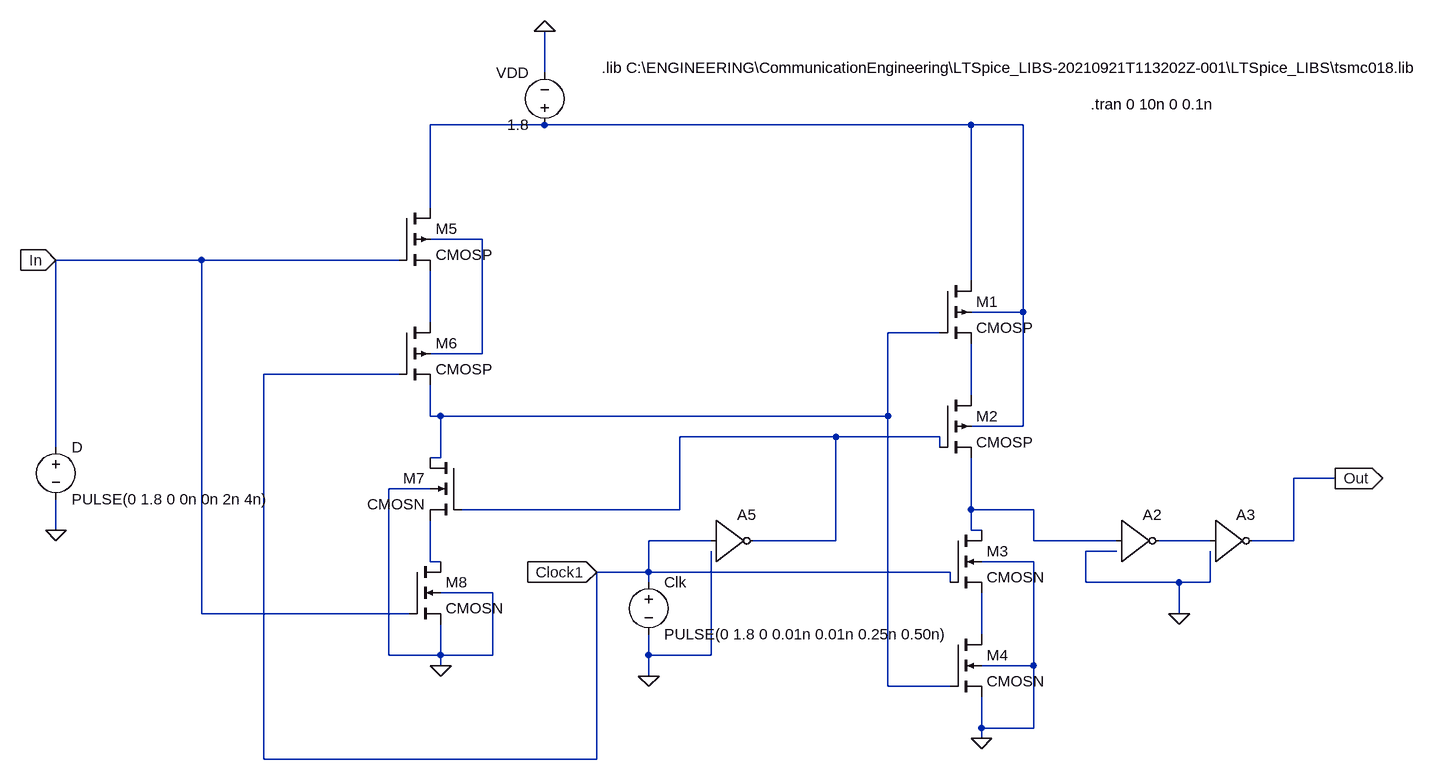
[diagram p0: schematic D_Flip_Flop_M_S__1.asc]
D_Flip_Flop_M_S__1.asc, the LTspice schematic file:
Version 4
SHEET 1 1376 1044
WIRE -160 -16 -160 -80
WIRE -160 64 -336 64
WIRE 496 64 -160 64
WIRE 576 64 496 64
WIRE -336 192 -336 64
WIRE -256 240 -336 240
WIRE -688 272 -912 272
WIRE -384 272 -688 272
WIRE 496 304 496 64
WIRE 576 352 576 64
WIRE 576 352 496 352
WIRE -336 368 -336 288
WIRE 448 384 368 384
WIRE -256 416 -256 240
WIRE -256 416 -336 416
WIRE -384 448 -592 448
WIRE 496 480 496 400
WIRE -336 512 -336 464
WIRE -320 512 -336 512
WIRE 368 512 368 384
WIRE 368 512 -320 512
WIRE 576 528 576 352
WIRE 576 528 496 528
WIRE 288 544 48 544
WIRE 448 544 288 544
WIRE -912 560 -912 272
WIRE 448 560 448 544
WIRE -320 576 -320 512
WIRE -320 576 -336 576
WIRE 1056 608 992 608
WIRE -336 624 -400 624
WIRE 48 656 48 544
WIRE 48 656 -288 656
WIRE 496 656 496 576
WIRE 592 656 496 656
WIRE -912 688 -912 640
WIRE 496 688 496 656
WIRE 512 688 496 688
WIRE 96 704 0 704
WIRE 288 704 288 544
WIRE 288 704 160 704
WIRE 592 704 592 656
WIRE 720 704 592 704
WIRE 864 704 784 704
WIRE 992 704 992 608
WIRE 992 704 928 704
WIRE 720 720 672 720
WIRE -336 736 -336 672
WIRE -320 736 -336 736
WIRE 592 736 512 736
WIRE 0 752 0 704
WIRE 0 752 -80 752
WIRE 464 752 0 752
WIRE 0 768 0 752
WIRE 464 768 464 752
WIRE 672 768 672 720
WIRE 816 768 672 768
WIRE 864 768 864 720
WIRE 864 768 816 768
WIRE -240 784 -320 784
WIRE -688 816 -688 272
WIRE -368 816 -688 816
WIRE 816 816 816 768
WIRE 512 848 512 784
WIRE -400 880 -400 624
WIRE -320 880 -320 832
WIRE -320 880 -400 880
WIRE -240 880 -240 784
WIRE -240 880 -320 880
WIRE 0 880 0 848
WIRE 96 880 96 720
WIRE 96 880 0 880
WIRE -320 896 -320 880
WIRE 592 896 592 736
WIRE 592 896 512 896
WIRE 0 912 0 880
WIRE 368 928 368 512
WIRE 464 928 368 928
WIRE 512 992 512 944
WIRE 592 992 592 896
WIRE 592 992 512 992
WIRE 512 1008 512 992
WIRE -592 1040 -592 448
WIRE -80 1040 -80 752
WIRE -80 1040 -592 1040
FLAG -160 -80 0
FLAG 0 912 0
FLAG 512 1008 0
FLAG -320 896 0
FLAG -912 688 0
FLAG -912 272 In
IOPIN -912 272 In
FLAG 1056 608 Out
IOPIN 1056 608 Out
FLAG -80 752 Clock1
IOPIN -80 752 In
FLAG 816 816 0
SYMBOL pmos4 448 304 R0
SYMATTR InstName M1
SYMATTR Value CMOSP
SYMATTR Value2 l=180n w=660n
SYMBOL pmos4 448 480 R0
SYMATTR InstName M2
SYMATTR Value CMOSP
SYMATTR Value2 l=180n w=660n
SYMBOL nmos4 464 688 R0
SYMATTR InstName M3
SYMATTR Value CMOSN
SYMATTR Value2 l=180n w=220n
SYMBOL nmos4 464 848 R0
SYMATTR InstName M4
SYMATTR Value CMOSN
SYMATTR Value2 l=180n w=220n
SYMBOL voltage -160 80 R180
WINDOW 0 24 96 Left 2
WINDOW 3 24 16 Left 2
SYMATTR InstName VDD
SYMATTR Value 1.8
SYMBOL voltage 0 752 R0
WINDOW 123 0 0 Left 0
WINDOW 39 0 0 Left 0
SYMATTR InstName Clk
SYMATTR Value PULSE(0 1.8 0 0.01n 0.01n 0.25n 0.50n)
SYMBOL pmos4 -384 192 R0
SYMATTR InstName M5
SYMATTR Value CMOSP
SYMATTR Value2 l=180n w=660n
SYMBOL pmos4 -384 368 R0
SYMATTR InstName M6
SYMATTR Value CMOSP
SYMATTR Value2 l=180n w=660n
SYMBOL nmos4 -288 576 M0
SYMATTR InstName M7
SYMATTR Value CMOSN
SYMATTR Value2 l=180n w=220n
SYMBOL nmos4 -368 736 R0
SYMATTR InstName M8
SYMATTR Value CMOSN
SYMATTR Value2 l=180n w=220n
SYMBOL voltage -912 544 R0
WINDOW 123 0 0 Left 0
WINDOW 39 0 0 Left 0
SYMATTR InstName D
SYMATTR Value PULSE(0 1.8 0 0n 0n 2n 4n)
SYMBOL Digital\\inv 720 640 R0
SYMATTR InstName A2
SYMBOL Digital\\inv 864 640 R0
SYMATTR InstName A3
SYMBOL Digital\\inv 96 640 R0
SYMATTR InstName A5
TEXT -72 -24 Left 2 !.lib C:\\ENGINEERING\\CommunicationEngineering\\LTSpice_LIBS-20210921T113202Z-001\\LTSpice_LIBS\\tsmc018.lib
TEXT 680 32 Left 2 !.tran 0 10n 0 0.1n

The netlist it stands for:
* D_Flip_Flop_M_S__1.asc
M1 N001 N004 N005 N001 CMOSP l=180n w=660n
M2 N005 N006 N007 N001 CMOSP l=180n w=660n
M3 N007 Clock1 N010 0 CMOSN l=180n w=220n
M4 N010 N004 0 0 CMOSN l=180n w=220n
VDD N001 0 1.8
V§Clk Clock1 0 PULSE(0 1.8 0 0.01n 0.01n 0.25n 0.50n)
M5 N001 In N003 N002 CMOSP l=180n w=660n
M6 N003 Clock1 N004 N002 CMOSP l=180n w=660n
M7 N004 N006 N009 0 CMOSN l=180n w=220n
M8 N009 In 0 0 CMOSN l=180n w=220n
V§D In 0 PULSE(0 1.8 0 0n 0n 2n 4n)
A2 N007 0 0 0 0 N008 0 0 BUF
A3 N008 0 0 0 0 Out 0 0 BUF
A5 Clock1 0 0 0 0 N006 0 0 BUF
.model NMOS NMOS
.model PMOS PMOS
.lib standard.mos
.lib C:\ENGINEERING\CommunicationEngineering\LTSpice_LIBS-20210921T113202Z-001\LTSpice_LIBS\tsmc018.lib
.tran 0 10n 0 0.1n
.backanno
.end

* Results of the author's LTspice run, read from the files saved beside the schematic
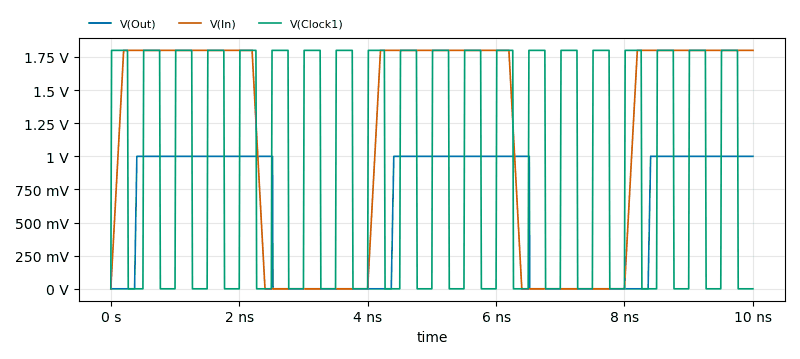
[diagram p1: Transient Analysis of D_Flip_Flop_M_S__1.asc, plotted from the saved traces]
* Transient Analysis, 1 run:
*   V(Out): min 0 V, max 1 V, average 588 mV, rms 766.8 mV, last 1 V
*   V(In): min 0 V, max 1.8 V, average 1.134 V, rms 1.41 V, last 1.8 V
*   V(Clock1): min 0 V, max 1.8 V, average 936 mV, rms 1.29 V, last 0 V